# EAGLE design E3-LED_1_3 (EAGLE 6.5.0)
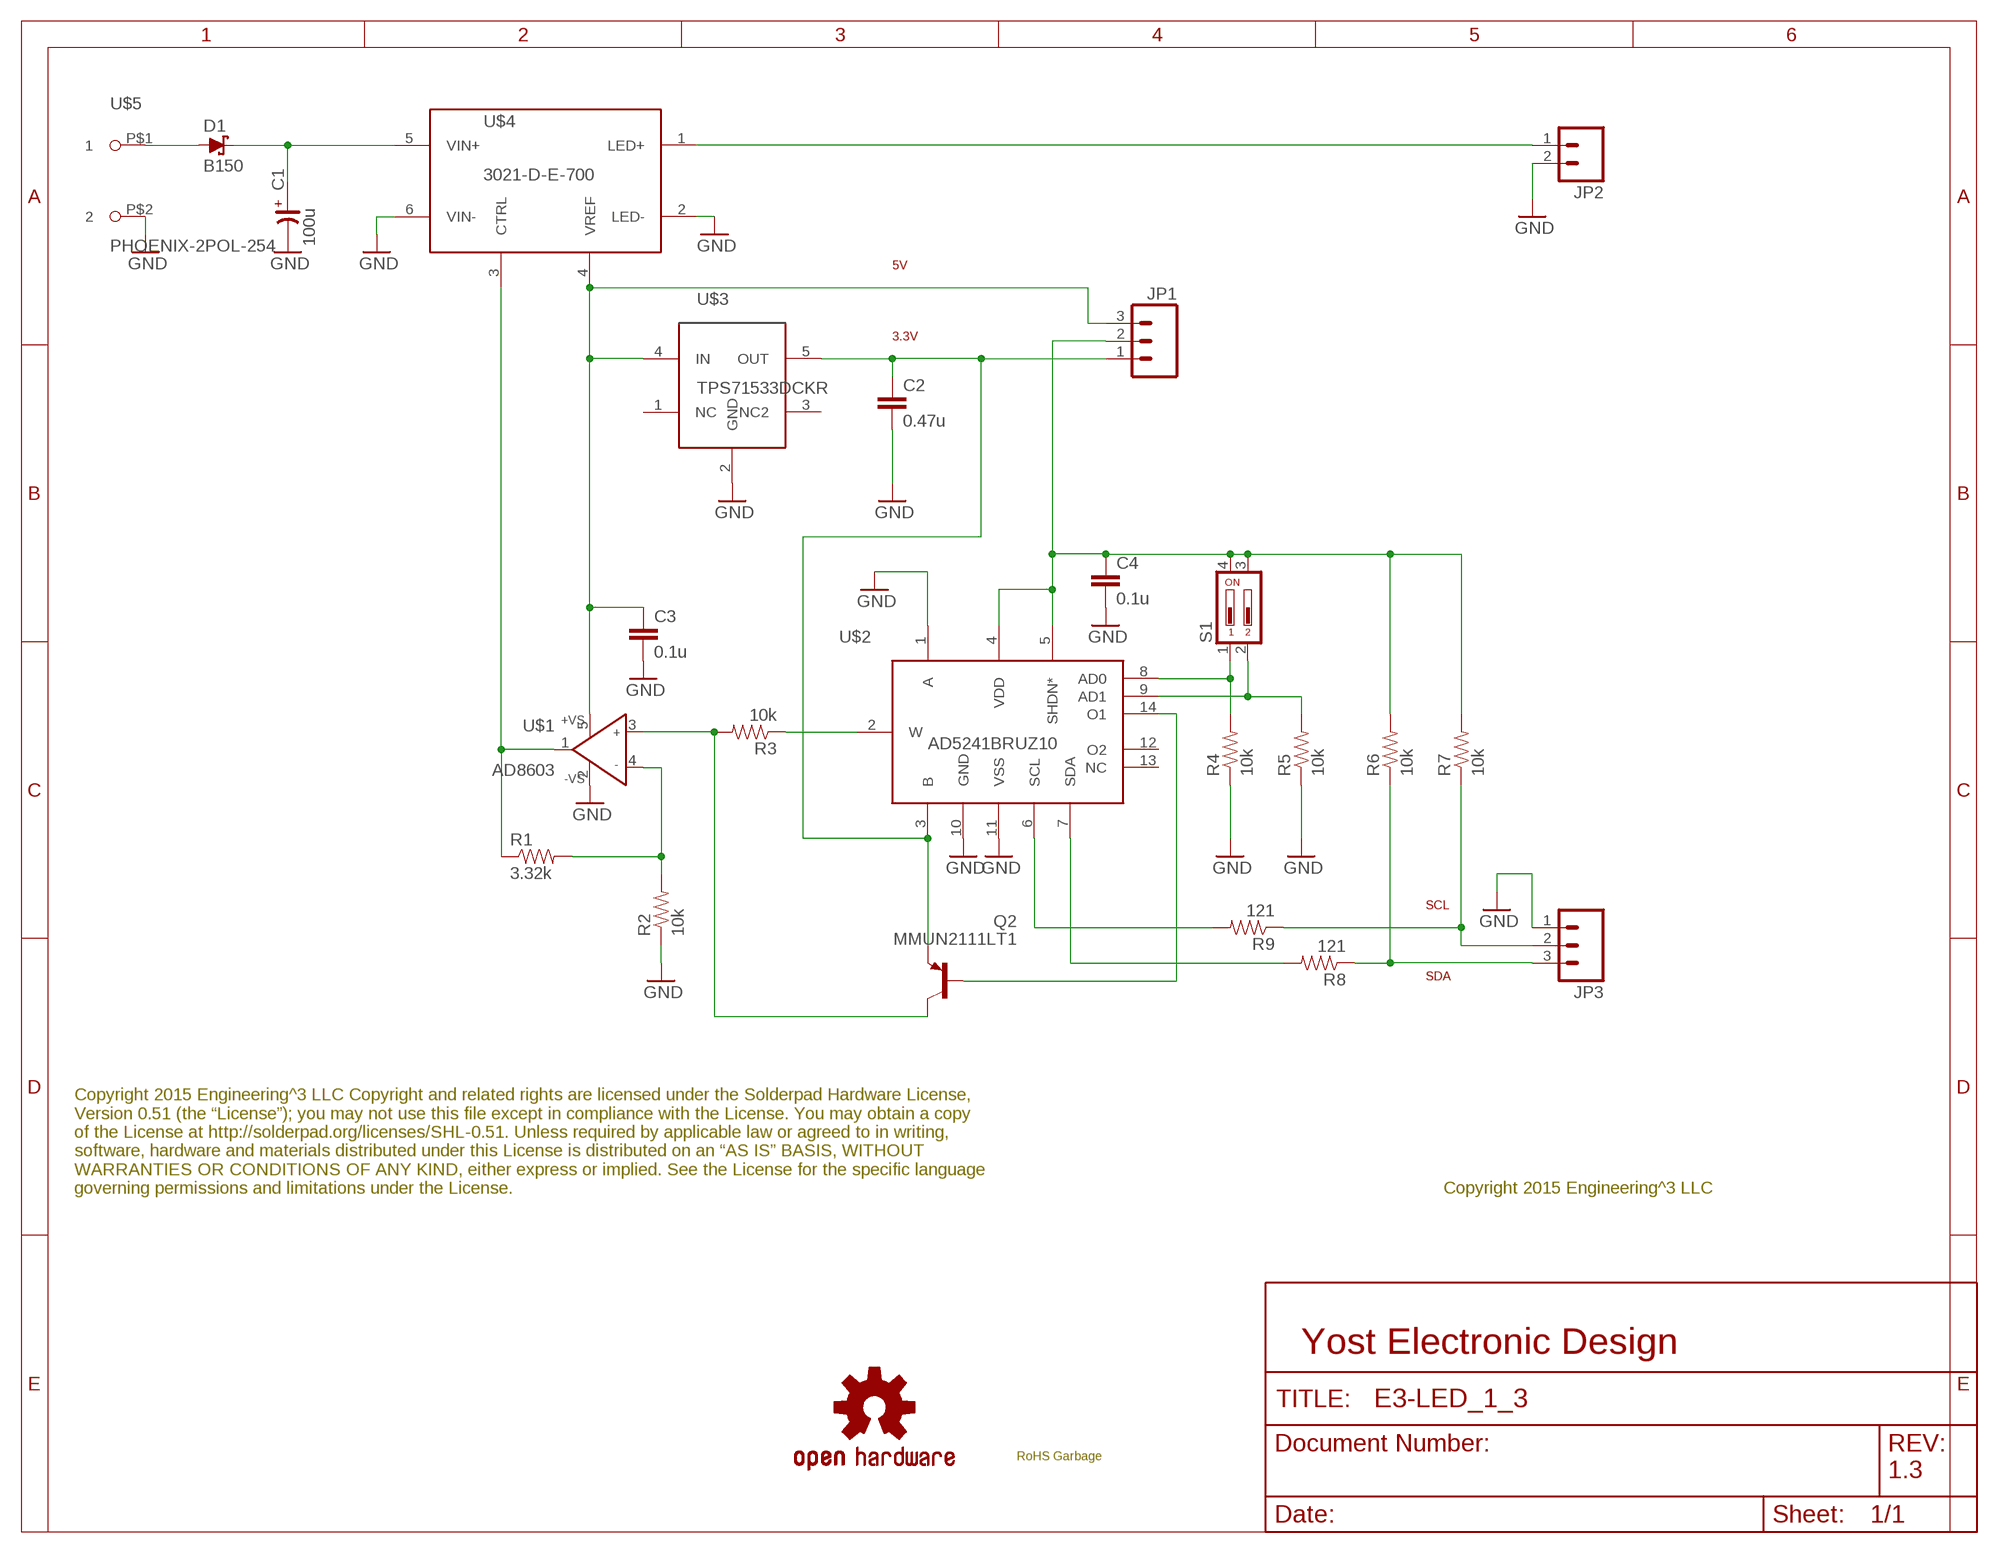
[diagram p0: schematic, sheet 1]

## Parts
C1  100u  C-PR-SMD-SV-E/F  [SV-E/F]
C2  0.47u  CAP0805  [0805]
C3  0.1u  CAP0805  [0805]
C4  0.1u  CAP0805  [0805]
D1  B150  SCHOTTKY-DIODESMB  [SMB]
JP1  M03PTH  [1X03]
JP2  M02PTH  [1X02]
JP3  M03PTH  [1X03]
LOGO1  OSHW-LOGOM  [OSHW-LOGO-M]
Q2  MMUN2111LT1  [SC59-BEC]
R1  3.32k  RESISTOR  [0805]
R2  10k  RESISTOR  [0805]
R3  10k  RESISTOR  [0805]
R4  10k  RESISTOR  [0805]
R5  10k  RESISTOR  [0805]
R6  10k  RESISTOR  [0805]
R7  10k  RESISTOR  [0805]
R8  121  RESISTOR  [0805]
R9  121  RESISTOR  [0805]
S1  SD4-02  [SD4-02]
U$1  AD8603  [SOT23-5]
U$2  AD5241BRUZ10  [TSOT14]
U$3  TPS71533DCKR  [SC70-5]
U$4  3021-D-E-700  [3021-D-E-700]
U$5  PHOENIX-2POL-254  [2-POL-254]
U$6  ROHS_GARBAGE  [ROHS_GARBAGE_5MM]

## Nets
3.3V: C2.1 JP1.1 Q2.E U$2.3(B) U$3.5(OUT)
5V: C3.1 JP1.3 U$1.5(+VS) U$3.4(IN) U$4.4(VREF)
5V/3.3V: C4.1 JP1.2 R6.2 R7.2 S1.3 S1.4 U$2.4(VDD) U$2.5(SHDN*)
AD0: R4.2 S1.1 U$2.8(AD0)
AD1: R5.2 S1.2 U$2.9(AD1)
CTRL: R1.1 U$1.1(OUT) U$4.3(CTRL)
GND: C1.- C2.2 C3.2 C4.2 JP2.2 JP3.1 R2.1 R4.1 R5.1 U$1.2(-VS) U$2.1(A) U$2.10(GND) U$2.11(VSS) U$3.2(GND) U$4.2(LED-) U$4.6(VIN-) U$5.P$2
LED+: JP2.1 U$4.1(LED+)
N$5: R1.2 R2.2 U$1.4(IN-)
N$9: Q2.C R3.2 U$1.3(NUMBER)
N$10: R3.1 U$2.2(W)
O1: Q2.B U$2.14(O1)
SCL: R9.2 U$2.6(SCL)
SCLPIN: JP3.2 R7.1 R9.1
SDA: R8.2 U$2.7(SDA)
SDAPIN: JP3.3 R6.1 R8.1
VIN: D1.A U$5.P$1
VINISO: C1.+ D1.C U$4.5(VIN+)
Unconnected: U$2.12(O2) U$2.13(NC) U$3.1(NC) U$3.3(NC2)

## Notes on the sheet
- 5V
- 3.3V
- SCL
- SDA
- Copyright 2015 Engineering^3 LLC Copyright and related rights are licensed under the Solderpad Hardware License, 
  Version 0.51 (the “License”); you may not use this file except in compliance with the License. You may obtain a copy 
  of the License at http://solderpad.org/licenses/SHL-0.51. Unless required by applicable law or agreed to in writing, 
  software, hardware and materials distributed under this License is distributed on an “AS IS” BASIS, WITHOUT 
  WARRANTIES OR CONDITIONS OF ANY KIND, either express or implied. See the License for the specific language 
  governing permissions and limitations under the License.
- Copyright 2015 Engineering^3 LLC
- Yost Electronic Design
- 1.3

## Library data of the parts
C1 = cap-pan40:C-PR: POLARIZED ELECTROLYTIC/TANTALUM
C2-C4 = SparkFun:CAP: Capacitor Standard 0603 ceramic capacitor, and 0.1" leaded capacitor.
D1 = diode:SCHOTTKY-DIODE: Schottky Diode
JP1 JP3 = SparkFun:M03: Header 3 Standard 3-pin 0.1" header. Use with straight break away headers (SKU : PRT-00116), right angle break away headers (PRT-00553), swiss pins (PRT-00743), machine pins (PRT-00117), and female headers (PRT-00115). Molex polarized connector foot print use with SKU : PRT-08232 with associated crimp pins and housings.
JP2 = SparkFun:M02: Header 2 Standard 2-pin 0.1" header. Use with straight break away headers (SKU : PRT-00116), right angle break away headers (PRT-00553), swiss pins (PRT-00743), machine pins (PRT-00117), and female headers (PRT-00115). Molex polarized connector foot print use with SKU : PRT-08233 with associated crimp pins and housings.
LOGO1 = SparkFun-Aesthetics:OSHW-LOGO: Open Source Hardware Logo This logo indicates the piece of hardware it is found on incorporates a OSHW license and/or adheres to the definition of open source hardware found here: http://freedomdefined.org/OSHW
Q2 = transistor-pnp:MMUN2111*: PNP Transistror
R1-R9 = SparkFun:RESISTOR: Resistor Basic schematic elements and footprints for 0603, 1206, and PTH 1/10th watt (small) resistors.
S1 = switch-dil:SD4-02: DIL/CODE SWITCH
U$1 = SparkFun:AD8603
U$2 = JLY Parts:AD5241BRUZ10
U$3 = JLY Parts:TPS71533DCKR
U$4 = JLY Parts:3021-D-E-700
U$5 = JLYCon.l#3:PHOENIX-2POL-254
U$6 = SchmalzHausPublic:ROHS_GARBAGE

## Board
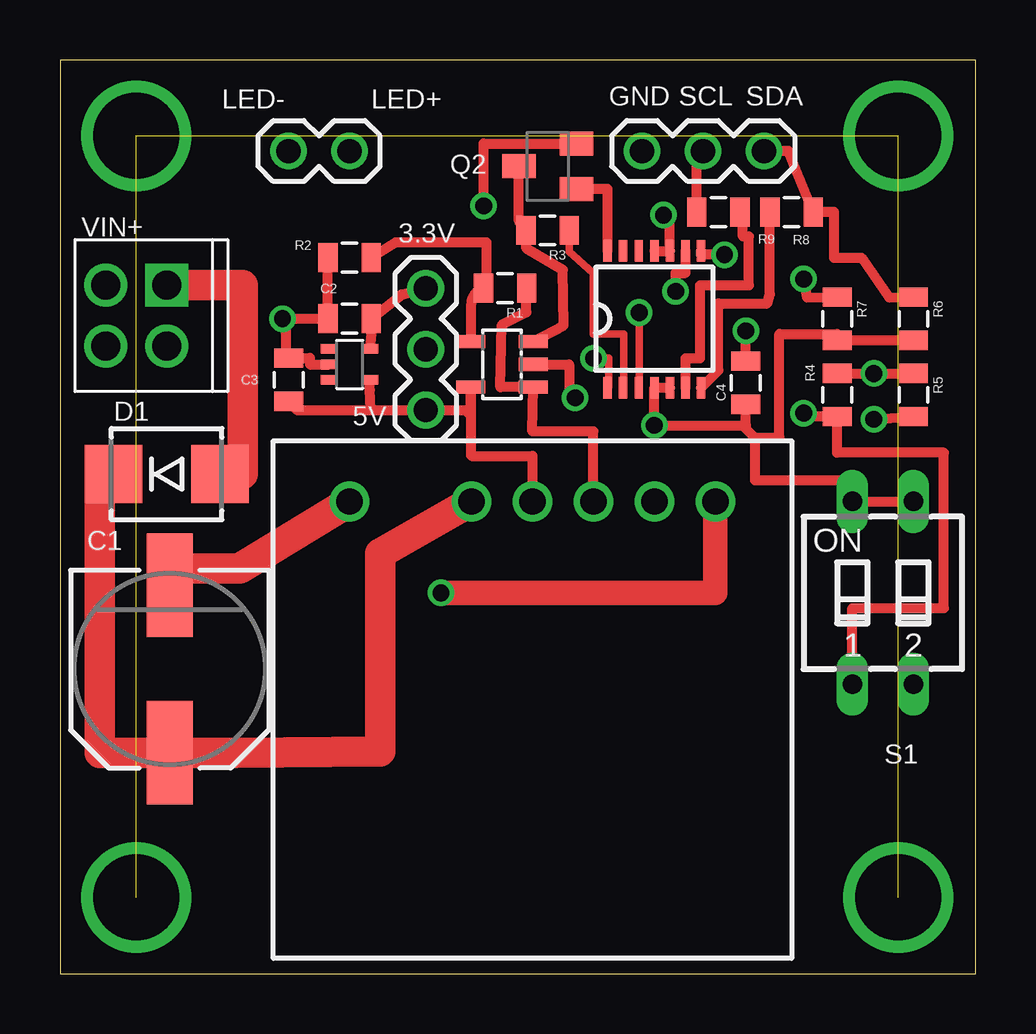
[diagram p1: board, top side]
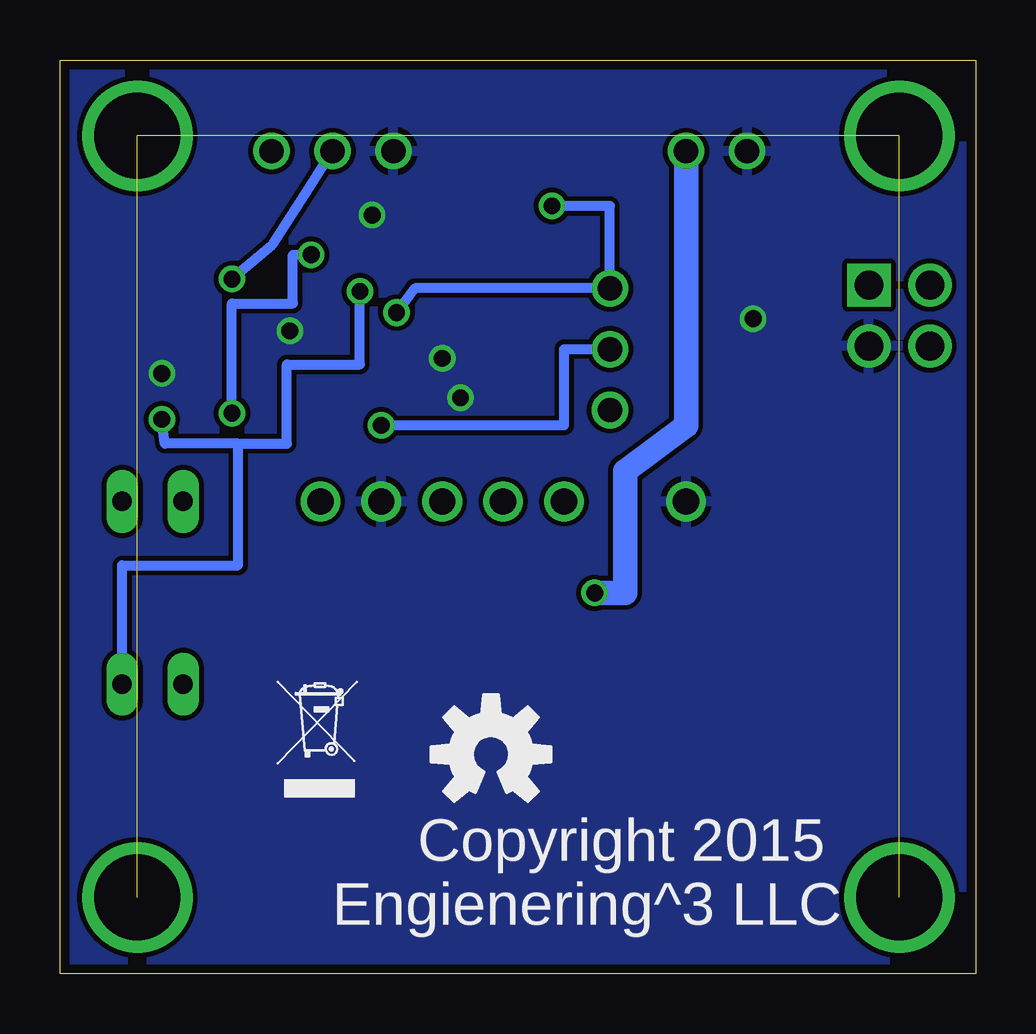
[diagram p2: board, bottom side, seen from below]

Size 38.15 x 38.09 mm. Coordinates in mm from the lower left corner, seen from the top.
Outline: 0,0 38.15,0 38.15,38.09 0,38.09 0,0
Copper layers (1*16): Top 0.035mm / dielectric 1.5mm / Bottom 0.035mm
Design rules "default *": minimum track width 10mil, minimum drill 24mil, track to track 8mil, track to pad 8mil, pad to pad 8mil, via to via 8mil, smd to smd 8mil, copper to edge 15mil, drill to drill 8mil, minimum pad ring 10mil, minimum via ring 8mil, stop-mask expansion 4mil, vias tented up to drill 0mil, thermal gap 10mil

### Footprints (pad centres in the part's own frame; a part is rotated, then mirrored left to right if it is on the bottom)
SV-E/F = smd 4.318 x 1.93: + -3.493,0; - 3.493,0
0805 = smd 0.8 x 1.2: 1 -0.9,0; 2 0.9,0
SMB = smd 2.4 x 2.4: A 2.223,0; C -2.223,0
1X03 = drill 1.016: 1 0,0; 2 2.54,0; 3 5.08,0
1X02 = drill 1.016: 1 0,0; 2 2.54,0
SC59-BEC = smd 1 x 1.4: B -0.95,-1.2; C 0,1.2; E 0.95,-1.2
SD4-02 = drill 0.813 long: 1 -1.27,-3.81; 2 1.27,-3.81; 3 1.27,3.81; 4 -1.27,3.81
SOT23-5 = smd 0.55 x 1.2: 1 -0.95,-1.3; 2 0,-1.3; 3 0.95,-1.3; 4 0.95,1.3; 5 -0.95,1.3
TSOT14 = smd 0.9 x 0.35: 1 -2.875,1.95; 2 -2.875,1.3; 3 -2.875,0.65; 4 -2.875,0; 5 -2.875,-0.65; 6 -2.875,-1.3; 7 -2.875,-1.95; 8 2.825,-1.95; 9 2.825,-1.3; 10 2.825,-0.65; 11 2.825,0; 12 2.825,0.65; 13 2.825,1.3; 14 2.825,1.95
SC70-5 = smd 0.4 x 0.7: 1 -0.65,-0.85; 2 0,-0.85; 3 0.65,-0.85; 4 0.65,0.85; 5 -0.65,0.85
3021-D-E-700 = drill 1.1: 1 0,2.54; 2 -2.54,2.54; 3 -5.08,2.54; 4 -7.62,2.54; 5 -10.16,2.54; 6 -15.24,2.54
2-POL-254 = drill 1.2 square: P$1 0,1.27 | drill 1.2: P$2 0,-1.27; P$3 -2.54,-1.27; P$4 -2.54,1.27

### Placement (x,y rotation side)
C1  4.57,12.7 90 top
C2  12.06,27.3 180 top
C3  9.53,24.77 90 top
C4  28.57,24.64 90 top
D1  4.45,20.83 0 top
JP1  15.24,28.57 270 top
JP2  12.06,34.29 180 top
JP3  24.26,34.29 0 top
LOGO1  20.19,9.14 0 bottom
Q2  20.32,33.66 90 top
R1  18.54,28.57 180 top
R2  12.06,29.84 0 top
R3  20.32,30.99 180 top
R4  32.38,24.13 270 top
R5  35.56,24.13 270 top
R6  35.56,27.3 270 top
R7  32.38,27.3 270 top
R8  30.48,31.75 180 top
R9  27.43,31.75 0 top
S1  34.29,15.88 0 top
U$1  18.41,25.4 90 top
U$2  24.77,27.3 90 top
U$3  12.06,25.4 270 top
U$4  27.3,17.14 0 top
U$5  4.45,27.43 0 top
U$6  29.08,7.37 0 bottom

### Tracks (layer width: path | path; a pad name or v marks a point on that pad's centre or on a via)
3.3V  (via drill 0.7)
  Top 0.305: U$2.3 arc90 24.13,24.45 v24.13,27.56
  Top 0.406: U$3.5 12.96,26.68 C2.1 14.23,28.31 JP1.1 | v17.65,32 17.65,34.6 Q2.E
  Bottom 0.406: v24.13,27.56 23.37,28.57 JP1.1 15.24,32 v17.65,32
5V
  Top 0.406: U$4.4 19.68,21.59 17.14,21.59 17.11,21.62 U$1.5 17.11,23.37 17.02,23.37 17.02,23.5 JP1.3 12.95,23.5 | C3.1 9.89,23.5 12.95,23.5 | 12.95,23.5 12.91,24.34 U$3.4
5V/3.3V  (via drill 0.7)
  Top 0.406: U$2.5 U$2.4 v24.77,22.86 28.45,22.86 | 28.45,22.86 28.96,22.35 | 28.96,22.35 28.96,20.57 33.02,20.57 S1.4 S1.3 | R6.2 R7.2 32.38,26.67 29.97,26.67 29.97,22.35 28.96,22.35 | 28.45,22.86 28.57,22.86 C4.1
  Bottom 0.406: JP1.2 17.14,26.04 17.14,22.86 v24.77,22.86
AD0  (via drill 0.7)
  Top 0.406: S1.1 33.02,15.24 36.83,15.24 36.83,21.72 32.38,21.72 R4.2 30.99,23.23 v30.99,23.37 | U$2.8 26.71,29.97 v27.69,29.97
  Bottom 0.406: v27.69,29.97 28.45,29.97 28.45,27.94 30.99,27.94 v30.99,23.37
AD1  (via drill 0.7)
  Top 0.406: v33.91,23.11 35.69,23.23 R5.2 | U$2.9 26.07,29.21 25.65,29.21 v25.65,28.45
  Bottom 0.406: v25.65,28.45 25.65,25.4 28.7,25.4 28.7,22.1 30.73,22.1 | v33.91,23.11 33.78,22.1 30.73,22.1 | S1.2 35.56,17.02 30.73,17.02 30.73,22.1
CTRL
  Top 0.406: R1.1 19.43,27.57 18.41,27.05 18.35,24.45 U$1.1 19.68,22.61 22.23,22.61 U$4.3
GND  (via drill 0.7)
  Top 0.305: U$2.1 arc90 22.86,24.48 22.86,25.65 v22.23,25.65
  Top 0.406: v25.15,31.62 25.41,31.62 U$2.10 U$2.11 | R2.1 C2.2 v9.27,27.3 9.4,27.18 9.44,27.18 9.44,25.78 9.53,25.78 C3.2 10.41,25.66 10.41,25.4 U$3.2 | R4.1 32.4,25.02 v33.91,25.02 35.55,25.02 R5.1 | C4.2 v28.57,26.8 | U$1.2 21.21,25.4 21.21,24 v21.46,24
  Top 1.27: C1.- 4.45,16.89 7.49,16.89 U$4.6
  pour Bottom: 0,38.1 0,0.25 37.97,0.38 37.97,37.72 37.59,37.97
LED+  (via drill 0.7)
  Top 1.016: U$4.1 27.3,15.88 v15.88,15.88
  Bottom 1.016: JP2.1 12.06,22.86 14.61,20.95 14.61,15.88 v15.88,15.88
N$1  (via drill 3.58)  (3 unrouted)
  other vias: 3.17,34.92 3.17,3.17 34.92,3.17 34.92,34.92
N$5
  Top 0.406: U$1.4 arc90 17.14,26.38 17.14,27.94 arc-90 17.78,28.57 | 17.78,28.57 R1.2 | 17.78,28.57 17.78,30.48 13.97,30.48 R2.2
N$9
  Top 0.406: Q2.C 19.12,31.38 R3.2 19.43,30.23 20.95,29.34 20.98,27.02 U$1.3
N$10
  Top 0.305: U$2.2 23.5,24.43 23.5,26.67 22.23,26.67 22.23,29.21 21.21,30.1 R3.1
O1
  Top 0.406: Q2.B 22.82,32.7 U$2.14
SCL
  Top 0.406: U$2.6 26.07,25.65 26.67,25.65 26.67,28.7 28.45,28.7 28.7,28.7 28.7,30.73 28.45,30.73 28.45,31.75 R9.2
SCLPIN  (via drill 0.7)
  Top 0.406: R7.1 31.11,28.19 v30.99,28.96 | R9.1 26.53,34.02 JP3.2
  Bottom 0.406: v30.99,28.96 29.34,30.35 27.94,32.51 JP3.2
SDA
  Top 0.406: U$2.7 27.43,25.15 27.43,27.94 29.46,27.94 29.58,28.31 R8.2
SDAPIN
  Top 0.406: JP3.3 30.35,34.29 R8.1 32.26,31.75 32.26,29.84 33.4,29.84 34.54,28.19 R6.1
VIN
  Top 1.27: D1.A 7.62,20.83 7.62,28.7 U$5.P$1
VINISO
  Top 1.27: D1.C 1.65,20.83 1.65,9.21 C1.+ 7.3,9.21 13.34,9.27 13.34,17.53 U$4.5

### Text on the board
tPlace: LED- | LED+ | GND | SCL | SDA | VIN+ | 3.3V | 5V
bPlace: Copyright 2015 / Engienering^3 LLC